# Altium project MODULIQ_Hub_ESP32-S3.PrjPcb
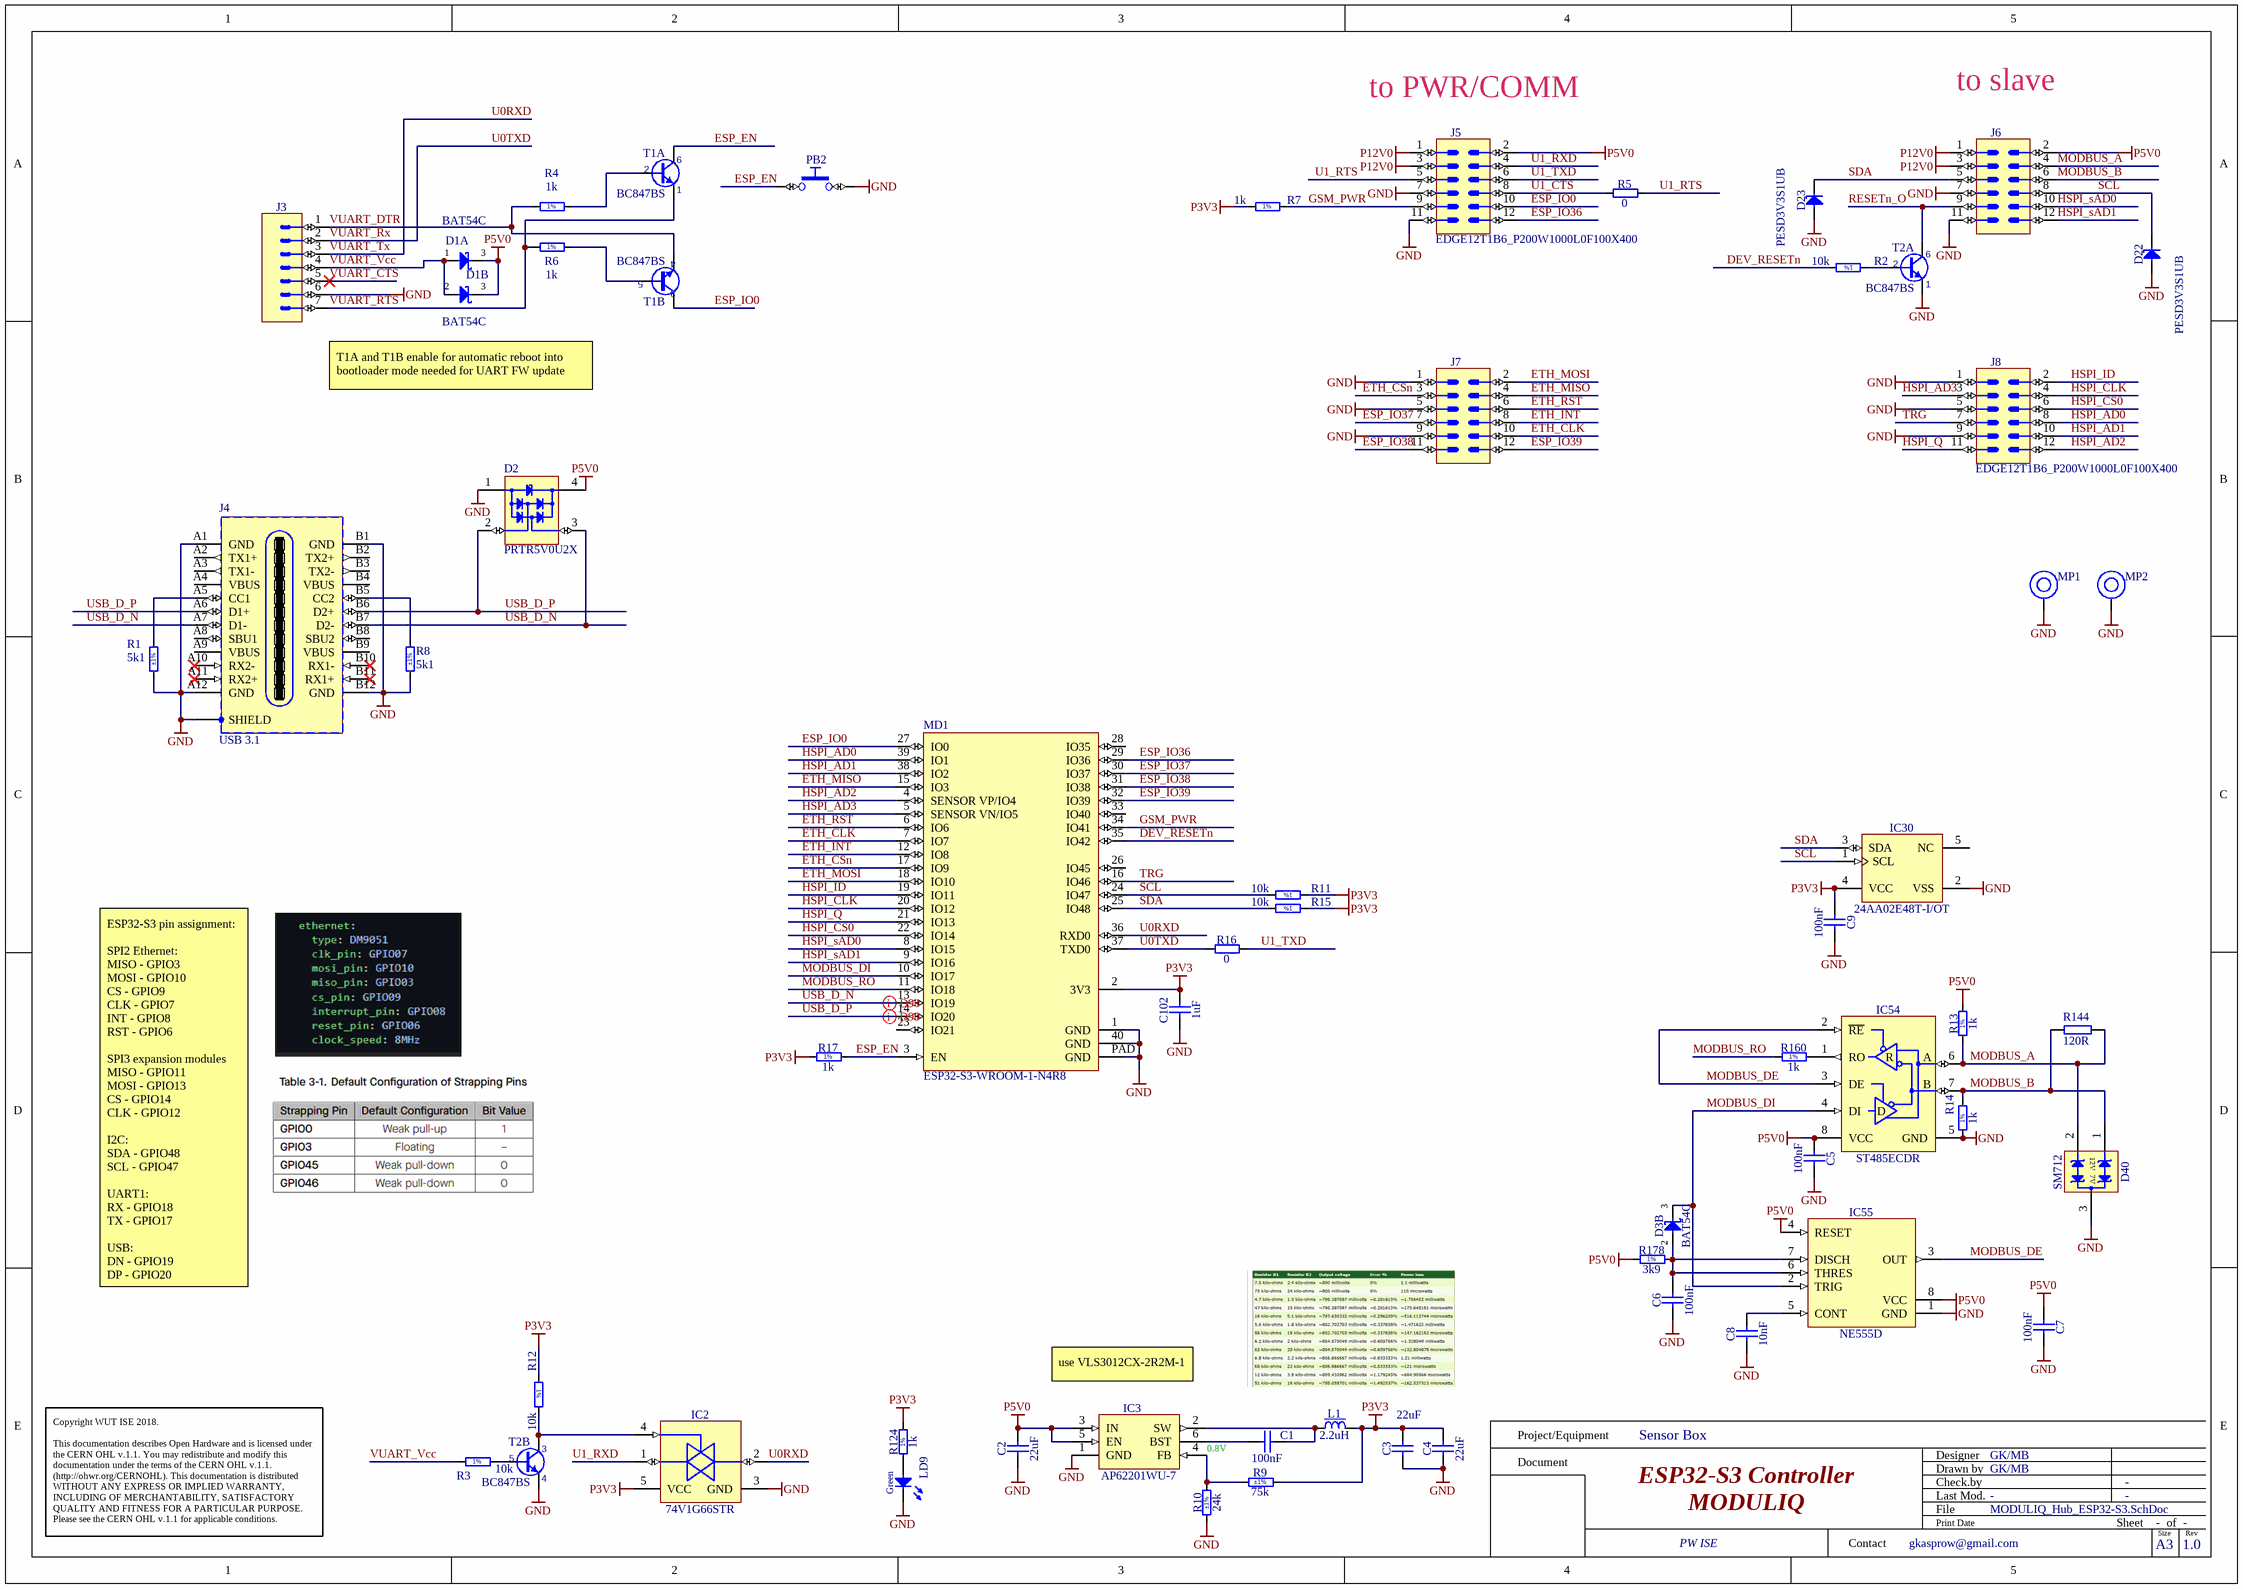
[diagram p0: MODULIQ_Hub_ESP32-S3.SchDoc]
1 sheet, 56 parts. Net scope: global (net labels, ports and power ports of the same name join across sheets).
Board file: MODULIQ_Hub_ESP32-S3.PcbDoc

## Sheet MODULIQ_Hub_ESP32-S3.SchDoc: ESP32-S3 Controller
size 420 x 297 mm; Author: GK/MB; CompanyName: WUT ISE; DrawnBy: GK/MB; Organization: WUT ISE; Address1: PW ISE; Address2: Nowowiejska 15/19 00-665 Warsaw; Address3: gkasprow@gmail.com; Revision: 1.0; SheetNumber: -; SheetTotal: -; ModifiedBy: -; CheckedDate: -; Title2: MODULIQ; DivGrp: WUT ISE; Designer: GK/MB; ModifiedDate: -; ProjectName: Sensor Box

### Parts
C1  100nF  [CAPC1005X55N]
C2  22uF  [CAPC2012X145N]
C3  22uF  [CAPC2012X145N]
C4  22uF  [CAPC2012X145N]
C5  100nF  [CAPC1005X55N]
C6  100nF  [CAPC1005X55N]
C7  100nF  [CAPC1005X55N]
C8  10nF  [CAPC1608X87N]
C9  100nF  [CAPC1005X55N]
C102  1uF  [CAPC1005X55N]
D1  BAT54C  [SOT95P240X130-3N]  (parts A,B of 2)
D2  PRTR5V0U2X  [SOT190P230X110-4N]
D3  BAT54C  [SOT95P240X130-3N]  (part B of 2)
D22  PESD3V3S1UB  [SODFL1608X65N]
D23  PESD3V3S1UB  [SODFL1608X65N]
D40  SM712  [SOT95P237X112-3N]
IC2  74V1G66STR  [SOT95P280X145-5N]
IC3  AP62201WU-7  [SOT95P285X110-6N]
IC30  24AA02E48T-I/OT  [SOT95P280X145-5N]
IC54  ST485ECDR  [SOIC127P600X175-8N]
IC55  NE555D  [SOIC127P600X175-8N]
J3  Header 7  [SAMTEC_TSW-107-07-L-S-LL]  (value not drawn)
J4  USB 3.1  [MOLEX_2047110001]
J5  (no value)  [EDGE12T1B6_P200W1000L0F100X400]
J6  (no value)  [EDGE12T5B10_P200W1000L0F100X400]
J7  (no value)  [EDGE12T5B10_P200W1000L0F100X400]
J8  (no value)  [EDGE12T1B6_P200W1000L0F100X400]
L1  2.2uH  [IND_MURATA_LQH44PN_P0]
LD9  Green  [LED_KINGBRIGHT_KPH-1608CGCK]
MD1  ESP32-S3-WROOM-1-N4R8  [ESP32-S3-WROOM-1]
MP1  M1.6 x 3mm  [97730306330]  (value not drawn)
MP2  M1.6 x 3mm  [97730306330]  (value not drawn)
PB2  Push Button  [PB_TYCO_FSMSM]  (value not drawn)
R1  5k1  Tolerance: ±1%  [RESC1005X40N]
R2  10k  [RESC1005X40N]
R3  10k  [RESC1005X40N]
R4  1k  [RESC1005X40N]
R5  0  [RESC1608X55N]
R6  1k  [RESC1005X40N]
R7  1k  [RESC1005X40N]
R8  5k1  Tolerance: ±1%  [RESC1005X40N]
R9  75k  Tolerance: ±1%  [RESC1005X40N]
R10  24k  Tolerance: ±1%  [RESC1005X40N]
R11  10k  [RESC1005X40N]
R12  10k  [RESC1005X40N]
R13  1k  [RESC1005X40N]
R14  1k  [RESC1005X40N]
R15  10k  [RESC1005X40N]
R16  0  [RESC1608X55N]
R17  1k  [RESC1005X40N]
R124  1k  [RESC1005X40N]
R144  120R  [1206R]
R160  1k  [RESC1005X40N]
R178  3k9  [RESC1005X40N]
T1  BC847BS  [SOT65P210X110-6N]  (parts A,B of 2)
T2  BC847BS  [SOT65P210X110-6N]  (parts A,B of 2)

### Nets
GND: C2.1 C3.1 C4.1 C5.2 C6.1 C7.2 C8.1 C9.2 C102.1 D2.1(GND) D22.2(A) D23.2(A) D40.3(GND) IC2.3(GND) IC3.1(GND) IC30.2(VSS) IC54.5(GND) IC55.1(GND) J3.6 J4.A1(GND) J4.A12(GND) J4.B1(GND) J4.B12(GND) J4.SHIELD J5.7 J5.11 J6.7 J6.11 J7.1 J7.5 J7.9 J8.1 J8.5 J8.9 LD9.1(C) MD1.1(GND) MD1.40(GND) MD1.PAD(GND) MP1.1 MP2.1 PB2.2 R1.1 R8.1 R10.1 R14.2 T2.1(E) T2.4(E)
P3V3: C3.2 C4.2 C9.1 C102.2 IC2.5(VCC) IC30.4(VCC) L1.2 MD1.2(3V3) R7.1 R9.2 R11.2 R12.2 R15.2 R17.1 R124.2
P5V0: C2.2 C5.1 C7.1 D1.3(COMC) D2.4(VCC) IC3.3(IN) IC3.5(EN) IC54.8(VCC) IC55.4(RESET) IC55.8(VCC) J5.2 J6.2 R13.1 R178.1
P12V0: J5.1 J5.3 J6.1 J6.3
DEV_RESETn: MD1.35(IO42) R2.1
ESP_EN: MD1.3(EN) PB2.1 R17.2 T1.6(C)
ESP_IO0: J5.10 MD1.27(IO0) T1.3(C)
ESP_IO36: J5.12 MD1.29(IO36)
ESP_IO37: J7.7 MD1.30(IO37)
ESP_IO38: J7.11 MD1.31(IO38)
ESP_IO39: J7.12 MD1.32(IO39)
ETH_CLK: J7.10 MD1.7(IO7)
ETH_CSn: J7.3 MD1.17(IO9)
ETH_INT: J7.8 MD1.12(IO8)
ETH_MISO: J7.4 MD1.15(IO3)
ETH_MOSI: J7.2 MD1.18(IO10)
ETH_RST: J7.6 MD1.6(IO6)
GSM_PWR: J5.9 MD1.34(IO41) R7.2
HSPI_AD0: J8.8 MD1.39(IO1)
HSPI_AD1: J8.10 MD1.38(IO2)
HSPI_AD2: J8.12 MD1.4(SENSOR_VP/IO4)
HSPI_AD3: J8.3 MD1.5(SENSOR_VN/IO5)
HSPI_CLK: J8.4 MD1.20(IO12)
HSPI_CS0: J8.6 MD1.22(IO14)
HSPI_ID: J8.2 MD1.19(IO11)
HSPI_Q: J8.11 MD1.21(IO13)
HSPI_sAD0: J6.10 MD1.8(IO15)
HSPI_sAD1: J6.12 MD1.9(IO16)
MODBUS_A: D40.2(I/O2) IC54.6(A) J6.4 R13.2 R144.2
MODBUS_B: D40.1(I/O1) IC54.7(B) J6.6 R14.1 R144.1
MODBUS_DE: IC54.2(~{RE}) IC54.3(DE) IC55.3(OUT)
MODBUS_DI: D3.3(COMC) IC54.4(DI) IC55.2(TRIG) MD1.10(IO17)
MODBUS_RO: MD1.11(IO18) R160.1
RESETn_O: J6.9 T2.6(C)
SCL: D22.1(C) IC30.1(SCL) J6.8 MD1.24(IO47) R11.1
SDA: D23.1(C) IC30.3(SDA) J6.5 MD1.25(IO48) R15.1
TRG: J8.7 MD1.16(IO46)
U0RXD: IC2.2(~{D0}) J3.3 MD1.36(RXD0)  [also labelled VUART_Tx]
U0TXD: J3.2 MD1.37(TXD0) R16.2  [also labelled VUART_Rx]
U1_CTS: J5.8 R5.1
U1_RTS: J5.5 R5.2
U1_RXD: IC2.1(D0) J5.4
U1_TXD: J5.6 R16.1
USB_D_N: D2.3(I/O2) J4.A7(D1-) J4.B7(D2-) MD1.13(IO19)
USB_D_P: D2.2(I/O1) J4.A6(D1+) J4.B6(D2+) MD1.14(IO20)
VUART_CTS: J3.5
VUART_DTR: J3.1 R4.1 T1.4(E)
VUART_RTS: J3.7 R6.1 T1.1(E)
VUART_Vcc: D1.1(A) D1.2(A) J3.4 R3.2
NetC1_1: C1.1 IC3.6(BST)
NetC1_2: C1.2 IC3.2(SW) L1.1
NetC6_2: C6.2 D3.2(A) IC55.6(THRES) IC55.7(DISCH) R178.2
NetC8_2: C8.2 IC55.5(CONT)
NetIC2_4: IC2.4(~{D1}) R12.1 T2.3(C)
NetIC3_4: IC3.4(FB) R9.1 R10.2
NetIC54_1: IC54.1(RO) R160.2
NetJ4_A5: J4.A5(CC1) R1.2
NetJ4_B5: J4.B5(CC2) R8.2
NetLD9_2: LD9.2(A) R124.1
NetR2_2: R2.2 T2.2(B)
NetR3_1: R3.1 T2.5(B)
NetR4_2: R4.2 T1.2(B)
NetR6_2: R6.2 T1.5(B)

Not connected (* = marked no-connect by the designer): IC30 5(NC); J4 A2(TX1+) A3(TX1-) A4(VBUS) A8(SBU1) A9(VBUS) A10(RX2-)* A11(RX2+)* B2(TX2+) B3(TX2-) B4(VBUS) B8(SBU2) B9(VBUS) B10(RX1-)* B11(RX1+)*; MD1 23(IO21) 26(IO45) 28(IO35) 33(IO40)

### Layout directives
differential pair; net class D90: USB_D_N, USB_D_P

### Notes on the sheet
- (near J5) to PWR/COMM
- to slave
- T1A and T1B enable for automatic reboot into bootloader mode needed for UART FW update
- ESP32-S3 pin assignment:
  SPI2 Ethernet:
  MISO - GPIO3
  MOSI - GPIO10
  CS - GPIO9
  CLK - GPIO7
  INT - GPIO8
  RST - GPIO6
  SPI3 expansion modules
  MISO - GPIO11
  MOSI - GPIO13
  CS - GPIO14
  CLK - GPIO12
  I2C:
  SDA - GPIO48
  SCL - GPIO47
  UART1:
  RX - GPIO18
  TX - GPIO17
  USB:
  DN - GPIO19
  DP - GPIO20
- use VLS3012CX-2R2M-1
- 0.8V
- Project/Equipment
- Document
- Designer
- Drawn by
- Check.by
- Copyright WUT ISE 2018.
  This documentation describes Open Hardware and is licensed under the CERN OHL v.1.1. You may redistribute and modify this documentation under the terms of the CERN OHL v.1.1. (http://ohwr.org/CERNOHL). This documentation is distributed WITHOUT ANY EXPRESS OR IMPLIED WARRANTY, INCLUDING OF MERCHANTABILITY, SATISFACTORY QUALITY AND FITNESS FOR A PARTICULAR PURPOSE. Please see the CERN OHL v.1.1 for applicable conditions.
- Contact
- File
- Last Mod.
- Print Date
- Sheet
- Size
- A3
- of
- Rev
- (in symbol R0402_1K_1%_0.0625W_100PPM) 1%
- (in symbol R0402_3K9_1%_0.0625W_100PPM) 1%
- (in symbol R0402_10K_1%_0.0625W_100PPM) 1%
- (in symbol SM712) 12V; 7V
- (in symbol ST485ECDR) R; D

### Library data of the parts
C1 = CC0402_100NF_16V_10%_X5R: Non-polarised capacitor; Part Description: SMD Multilayer Chip Ceramic Capacitor; Manufacturer: GENERIC; Manufacturer1 Part Number: GRM155R61C104KA88D; Voltage: 16V; TC: X5R; Tolerance: ±10%; Table: Capacitors SMD; Part Number: CC0402_100NF_16V_10%_X5R; Component Kind: Standard; Component Type: Standard; Pin Count: 2; Value: 100nF; Status: None; Manufacturer Part Number: CC0402_100NF_16V_10%_X5R; Case: 0402; Mounted: Yes; Socket: No; SMD: Yes; Manufacturer1 Example: MURATA; Manufacturer1 ComponentHeight: 0.55mm; HelpURL: \\cern.ch\dfs\Applications\Altium\Datasheets\CC0402_X5R_MURATA_GRM.pdf; Author: CERN DEM JLC; CreateDate: 2013-12-10; LatestRevisionDate: 2013-12-10
C2-C4 = CC0805_22UF_25V_20%_X5R: Non-polarised capacitor; Part Description: Chip Multilayer Ceramic Capacitor for General Purpose; Manufacturer: GENERIC; Manufacturer1 Part Number: GRM21BR61E226ME44; Voltage: 25V; TC: X5R; Tolerance: ±20%; Part Number: CC0805_22UF_25V_20%_X5R; Component Kind: Standard; Component Type: Standard; Pin Count: 2; Value: 22uF; Status: Preferred; Manufacturer Part Number: CC0805_22UF_25V_20%_X5R; Case: 0805; Mounted: Yes; Socket: No; SMD: Yes; Manufacturer1 Example: MURATA; Manufacturer1 ComponentHeight: 1.45mm; HelpURL: \\cern.ch\dfs\Applications\Altium\Datasheets\CC0805_MURATA_GRM21BR61E226ME44.pdf; Author: CERN DEM WB; CreateDate: 08.10.2021; LatestRevisionDate: 08.10.2021; Sense: No; ComponentHeight: 1.45mm
C5-C7 C9 = CC0402_100NF_16V_10%_X7R: Non-polarised capacitor; Part Description: SMD Multilayer Chip Ceramic Capacitor; Manufacturer: GENERIC; Manufacturer1 Part Number: GRM155R71C104KA88D; Voltage: 16V; TC: X7R; Tolerance: ±10%; Part Number: CC0402_100NF_16V_10%_X7R; Component Kind: Standard; Component Type: Standard; Pin Count: 2; Value: 100nF; Status: Not Recommended; Manufacturer Part Number: CC0402_100NF_16V_10%_X7R; Case: 0402; Mounted: Yes; Socket: No; SMD: Yes; Manufacturer1 Example: MURATA; Manufacturer1 ComponentHeight: 0.55mm; HelpURL: \\cern.ch\dfs\Applications\Altium\Datasheets\CC0402_X7R_MURATA_GRM.pdf; Author: CERN DEM JLC; CreateDate: 05.12.2013; LatestRevisionDate: 03.12.2007; Sense: No
C8 = CC0603_10NF_50V_5%_C0G: Non-polarised capacitor; Part Description: SMD Multilayer Chip Ceramic Capacitor; Manufacturer: GENERIC; Manufacturer1 Part Number: C1608C0G1H103J080AA; Voltage: 50V; TC: C0G/NP0; Tolerance: ±5%; Part Number: CC0603_10NF_50V_5%_C0G; Component Kind: Standard; Component Type: Standard; Pin Count: 2; Value: 10nF; Status: Preferred; Manufacturer Part Number: CC0603_10NF_50V_5%_C0G; Case: 0603; Mounted: Yes; Socket: No; SMD: Yes; Sense: No; Manufacturer1 Example: TDK; Manufacturer1 ComponentHeight: 0.9mm; HelpURL: \\cern.ch\dfs\Applications\Altium\Datasheets\CC0603_C0G_TDK_C.pdf; Author: CERN DEM JLC; CreateDate: 10.12.2014; LatestRevisionDate: 10.12.2014
C102 = CC0402_1UF_16V_10%_X5R: Non-polarised capacitor; Part Description: SMD Multilayer Chip Ceramic Capacitor; Manufacturer: GENERIC; Manufacturer1 Part Number: C1005X5R1C105KT; Voltage: 16V; TC: X5R; Tolerance: ±10%; Part Number: CC0402_1UF_16V_10%_X5R; Component Kind: Standard; Component Type: Standard; Pin Count: 2; Value: 1uF; Status: Preferred; Manufacturer Part Number: CC0402_1UF_16V_10%_X5R; Case: 0402; Mounted: Yes; Socket: No; SMD: Yes; Sense: No; Manufacturer1 Example: TDK; Manufacturer1 ComponentHeight: 0.55mm; HelpURL: \\cern.ch\dfs\Applications\Altium\Datasheets\CC0402_X5R_TDK_C.pdf; Author: CERN DEM JLC; CreateDate: 25.10.2012; LatestRevisionDate: 25.10.2012
D1 D3 = BAT54C: Dual Common Cathode Schottky Diodes; Part Description: Dual Common Cathode Small Signal Schottky Diode; Manufacturer: FAIRCHILD SEMICONDUCTOR; Voltage: 30V; Power: 200mA; PressFit: No; Bonding: No; Part Number: BAT54C; Component Kind: Standard; Component Type: Standard; Device: BAT54C; PackageDescription: SOT23 3-Leads, Pitch 0.95mm - Body 1.3x2.9mm, IPC Medium Density; Manufacturer Part Number: BAT54C; Pin Count: 3; Case: SOT23-3; Mounted: Yes; Socket: No; SMD: Yes; Sense: No; ComponentHeight: 1.30mm; HelpURL: \\cern.ch\dfs\Applications\Altium\Datasheets\BAT54C.pdf; Author: CERN DEM JLC; CreateDate: 17.09.2009; LatestRevisionDate: 27.05.2010
D2 = PRTR5V0U2X: Ultra Low Capacitance Double Rail-to-Rail ESD Protection Diode; Part Description: Ultra Low Capacitance (1pF) Double Rail-to-Rail ESD Protection Diode (8kV); Manufacturer: NXP SEMICONDUCTORS; Voltage: 5.5V; PressFit: No; Bonding: No; Part Number: PRTR5V0U2X; Component Kind: Standard; Component Type: Standard; Device: PRTR5V0U2X; PackageDescription: SOT143B, SOT, 1.90mm Pitch; 4 Pin, 1.30mm W X 2.90mm L X 1.10mm H body, IPC Medium Density; Manufacturer Part Number: PRTR5V0U2X; Pin Count: 4; Case: SOT143B; Mounted: Yes; Socket: No; SMD: Yes; Sense: No; ComponentHeight: 1.1mm; HelpURL: \\cern.ch\dfs\Applications\Altium\Datasheets\PRTR5V0U2X.pdf; Author: CERN DEM JLC; CreateDate: 3/22/2011; LatestRevisionDate: 3/22/2011
D22 D23 = PESD3V3S1UB: ESD protection diode; Part Description: ESD protection diode (23kV); Manufacturer: NXP SEMICONDUCTORS; Voltage: 3V3; Power: 330W; PressFit: No; Bonding: No; Part Number: PESD3V3S1UB; Component Kind: Standard; Component Type: Standard; Device: PESD3V3S1UB; PackageDescription: Ultra Small Outline Diode Flat Lead (SOD-523), Body; 1.2mm L X 0.8mm W X 0.65mm H, IPC Medium Density; Manufacturer Part Number: PESD3V3S1UB; Pin Count: 2; Case: SOD523; Mounted: Yes; Socket: No; SMD: Yes; Sense: No; ComponentHeight: 0.65mm; HelpURL: \\cern.ch\dfs\Applications\Altium\Datasheets\PESD3V3S1UB.pdf; Author: CERN DEM JLC; CreateDate: 29.11.2012; LatestRevisionDate: 29.11.2012
D40 = SM712: Asymmetrical TVS Diode for Extended Common-Mode RS-485; Manufacturer: SEMTECH; Voltage: 12V/-7V; Power: 400W; PressFit: No; Bonding: No; Part Number: SM712; Component Kind: Standard; Component Type: Standard; Device: SM712; PackageDescription: SOT, 0.95mm, pitch; 3 pin,1.30mm W X 2.92mm L X 1.12mm H body, IPC Medium Density; Status: Obsolete; Part Description: Asymmetrical TVS Diode for Extended Common-Mode RS-485; Manufacturer Part Number: SM712; Pin Count: 3; Case: SOT-23; Mounted: Yes; Socket: No; SMD: Yes; Sense: No; ComponentHeight: 1.12mm; HelpURL: \\cern.ch\dfs\Applications\Altium\Datasheets\SM712.pdf; Author: CERN DEM JLC; CreateDate: 23.04.2012; LatestRevisionDate: 23.04.2012
IC2 = 74V1G66STR: Single Bilateral Switch; Manufacturer: ST MICROELECTRONICS; PressFit: No; Bonding: No; Part Number: 74V1G66STR; Component Kind: Standard; Component Type: Standard; Device: 74V1G66STR; PackageDescription: SOT, 0.95mm pitch; 5 pin, 1.60mm W X 2.90mm L X 1.45mm H body, IPC Medium Density; Part Description: Single Bilateral Switch; Manufacturer Part Number: 74V1G66STR; Pin Count: 5; Case: SOT23-5; Mounted: Yes; Socket: No; SMD: Yes; Sense: No; ComponentHeight: 1.45mm; Author: CERN DEM JLC; HelpURL: \\cern.ch\dfs\Applications\Altium\Datasheets\74V1G66STR.pdf; CreateDate: 20.01.2014; LatestRevisionDate: 20.01.2014
IC3 = PM_AP62201WU-7: LIGHT LOAD IMPROVED 1.5A SYNCH DC/DC BUCK CONVERTER; Manufacturer: DIODES INCORPORATED; PressFit: No; Bonding: No; Part Number: AP62201WU-7; Component Kind: Standard; Component Type: Standard; Device: AP62201WU-7; PackageDescription: SOT23, 0.95mm pitch; 6 pin, 1.6mm W X 3.0mm L X 1.45mm H body, IPC Medium Density; Part Description: LIGHT LOAD IMPROVED 1.5A SYNCH DC/DC BUCK CONVERTER; Manufacturer Part Number: AP62201WU-7; Pin Count: 5; Case: SOT26; Mounted: Yes; Socket: No; SMD: Yes; Sense: No; ComponentHeight: 1.45mm; HelpURL: \\cern.ch\dfs\Applications\Altium\Datasheets\AP133-WG-7.pdf; Author: GK; CreateDate: 10.07.2015; LatestRevisionDate: 10.07.2015
IC30 = 24AA02E48T-I/OT: 1.7V-5.5V, 2K I2C Serial EEPROM With EUI-48 Node Identity; Manufacturer: MICROCHIP TECHNOLOGY; PressFit: No; Bonding: No; Part Number: 24AA02E48T-I/OT; Component Kind: Standard; Component Type: Standard; Device: 24AA02E48T-I/OT; PackageDescription: SOT, 0.95mm pitch; 5 pin, 1.60mm W X 2.90mm L X 1.45mm H body, IPC Medium Density; Part Description: 1.7V-5.5V, 2K I2C Serial EEPROM With EUI-48 Node Identity; Manufacturer Part Number: 24AA02E48T-I/OT; Pin Count: 5; Case: SOT23-5; Mounted: Yes; Socket: No; SMD: Yes; Sense: No; ComponentHeight: 1.45mm; HelpURL: \\cern.ch\dfs\Applications\Altium\Datasheets\24AA02E48T-I-OT.pdf; Author: CERN DEM MR; CreateDate: 31.03.2016; LatestRevisionDate: 31.03.2016
IC54 = ST485ECDR: ±15kV ESD-Protected, Low Power  RS-485/RS-422 Transceiver; Manufacturer: ST MICROELECTRONICS; PressFit: No; Bonding: No; Part Number: ST485ECDR; Component Kind: Standard; Component Type: Standard; Device: ST485ECDR; PackageDescription: SOIC 8, Pitch 1.27mm - Body 4x5mm, IPC Medium Density; Part Description: ±15kV ESD-Protected, Low Power  RS-485/RS-422 Transceiver; Manufacturer Part Number: ST485ECDR; Pin Count: 8; Case: SOIC8; Mounted: Yes; Socket: No; SMD: Yes; Sense: No; ComponentHeight: 1.75mm; Author: CERN DEM MR; HelpURL: \\cern.ch\dfs\Applications\Altium\Datasheets\ST485ECDR.pdf; CreateDate: 15.02.2018; LatestRevisionDate: 15.02.2018
IC55 = NE555D: Precision Timer; Manufacturer: TEXAS INSTRUMENTS; PressFit: No; Bonding: No; Part Number: NE555D; Component Kind: Standard; Component Type: Standard; Device: NE555D; PackageDescription: SOIC 8, Pitch 1.27mm, Body 4x5mm, IPC Medium Density; Part Description: Precision Timer; Manufacturer Part Number: NE555D; Pin Count: 8; Case: SOIC8; Mounted: Yes; Socket: No; SMD: Yes; Sense: No; ComponentHeight: 1.75mm; Author: CERN DEM JMW; HelpURL: \\cern.ch\dfs\Applications\Altium\Datasheets\NE555D.pdf; CreateDate: 16.04.2009; LatestRevisionDate: 16.04.2009
J3 = SAMTEC_TSW-107-07-L-S-LL: Connector 7 Male; Part Description: 7 Contacts, Pitch 2.54mm, Single Row  Through Mount Straigh Header (Post Lead 5.84mm, Tail Lead 2.54mm, Insulator 2.54mm); Manufacturer: SAMTEC; PressFit: No; Part Number: SAMTEC_TSW-107-07-L-S-LL; Component Kind: Standard; Component Type: Standard; Pin Count: 7; Family: Header 7; Mounted: Yes; Socket: No; SMD: No; Sense: No; Status: None; Manufacturer Part Number: TSW-107-07-L-S-LL; ComponentHeight: 8.38mm; HelpURL: \\cern.ch\dfs\Applications\Altium\Datasheets\SAMTEC_TSW-107-07-L-S-LL.pdf; Author: CERN DEM MR; CreateDate: 07.12.2016; LatestRevisionDate: 07.12.2016
J4 = 2047110001: 2x12 Pin + 1 Shield  USB Type C Receptacle; Part Description: Universal Serial Bus (USB) Shielded I/O Receptacle, Type C, Vertical, Surface Mount, 0.76µm Gold (Au) Plating, 1.40mm Solder Tab; Manufacturer: MOLEX; Arena Part Number: 125-000079; PressFit: No; Part Number: 2047110001; Component Kind: Standard; Component Type: Standard; Pin Count: 30; Family: USB 3.1; SMD: Yes; Status: Active; Manufacturer Part Number: 2047110001; ComponentHeight: 9.8mm; Author: Michal Beldyga; CreateDate: 4/29/2025; LatestRevisionDate: 4/29/2025
J5 J8 = PCB Edge Connector 12 (2x6): Part Number: EDGE10T1B6_P200W1000L0F100X400; Part Description: 10 Contacts Board Edge Connector, Pitch 2mm, Length 0mm, Width 10mm, Finger Lenght 4mm, Finger Width 1mm; Mounted: No; PressFit: No; Component Kind: Standard (No BOM); Component Type: Standard (No BOM); Pin Count: 12; Socket: No; SMD: No; Sense: No; Status: None; ComponentHeight: 0mm; HelpURL: \\cern.ch\dfs\Applications\Altium\Datasheets\EDGE10T1B6_P200W1000L0F100X400.pdf; Author: CERN DEM MR; CreateDate: 14.02.2018; LatestRevisionDate: 14.02.2018
J6 J7 = PCB Edge Connector 12 (2x6) R: PCB Edge Connector 12 (2x6); Part Description: 12 Contacts Board Edge Connector, Pitch 2mm, Length 0mm, Width 10mm, Finger Lenght 4mm, Finger Width 1mm; Mounted: No; PressFit: No; Part Number: EDGE12T5B10_P200W1000L0F100X400; Component Kind: Standard (No BOM); Component Type: Standard (No BOM); Pin Count: 12; Socket: No; SMD: No; Sense: No; Status: None; ComponentHeight: 0mm; HelpURL: \\cern.ch\dfs\Applications\Altium\Datasheets\EDGE10T5B10_P200W1000L0F100X400.pdf; Author: GK; CreateDate: 14.02.2018; LatestRevisionDate: 14.02.2018
L1 = IND_2.2UH_20%_MURATA_LQH44PN2R2MP0L: Inductor With Core; Part Description: Wire Wound Ferrite Inductor for Power Lines; Manufacturer: MURATA; Power: 1.8A; Resistance: 0R049; Tolerance: ±20%; Part Number: IND_2.2UH_20%_MURATA_LQH44PN2R2MP0L; Component Kind: Standard; Component Type: Standard; Pin Count: 2; Value: 2.2uH; Status: None; Manufacturer Part Number: LQH44PN2R2MP0L; Case: 4040; Mounted: Yes; Socket: No; SMD: Yes; Sense: No; ComponentHeight: 1.8mm; HelpURL: \\cern.ch\dfs\Applications\Altium\Datasheets\IND_MURATA_LQH44PN_P0.pdf; Author: CERN DEM JLC; CreateDate: 14.02.2018; LatestRevisionDate: 14.02.2018
LD9 = LED_KINGBRIGHT_KPH-1608CGCK: LED Green 1C 2A; Part Description: SMD Green LED, Case 1.6mmX0.8mm(0603), 0.65mm Thickness; PressFit: No; Bonding: No; Part Number: LED_KINGBRIGHT_KPH-1608CGCK; Component Kind: Standard; Component Type: Standard; Color: Green; PackageDescription: SMT Green LED, Case 0603, Body L 1.6 x W 0.8mm H 0.65mm; Manufacturer: KINGBRIGHT; Manufacturer Part Number: KPH-1608CGCK; Pin Count: 2; Mounted: Yes; Socket: No; SMD: Yes; Sense: No; ComponentHeight: 0.65mm; HelpURL: \\cern.ch\dfs\Applications\Altium\Datasheets\LED_KINGBRIGHT_KPH-1608CGCK.pdf; Author: CERN DEM JLC; CreateDate: 03/07/2017; LatestRevisionDate: 03/07/2017
MD1 = ESP32-S3-WROOM-1-N4R8: WiFi-Modul 802.11/BT 2, 4-2, 5GHz 150Mb/s; Manufacturer: Espressif Systems; Max Supply Voltage: 3.6V; Min Supply Voltage: 3V; Operating Supply Voltage: 3.3V; Supplier: Digikey; Supplier Part Number: 5407-ESP32-S3-WROOM-1-N4R8CT-ND; Manufacturer Part Number: ESP32-S3-WROOM-1-N4R8; RoHS: No; Stock: 3923; Pricing: 1=5.71, 10=4.941, 25=4.6748, 100=4.3087, 250=4.0894, 650=3.87826, 1300=3.7356, 1950=3.65604 (USD); Pins: 41NUMBER; Min Operating Temperature: -40°C; Max Operating Temperature: 65°C; Length: 25.5mm; Width: 18mm; Height - Seated (Max): 3.25mm; Terminal Pitch: 1.27mm; ComponentLink1URL: https://datasheet.octopart.com/ESP32-S3-WROOM-1-N4R8-Espressif-Systems-datasheet-165560563.pdf?src-supplier=TME; ComponentLink1Description: https://datasheet.octopart.com/ESP32-S3-WROOM-1-N4R8-Espressif-Systems-datasheet-165560563.pdf?src-supplier=TME
MP1 MP2 = 97730306330R: WA-SMSI SMT Steel Spacer with internal Thread Bottom closed, OD 3.3mm, M1.6 x 3mm; Manufacturer: Wurth Elektronik; Inside Thread Length: 1.8mm; Surface: Tin; ComponentLink1Description: Website Link; ComponentLink1URL: https://www.we-online.com/redexpert/article/97730306330R?ad; ComponentLink2Description: Datasheet Link; ComponentLink2URL: https://www.we-online.com/redexpert/spec/97730306330R?ad; Manufacturer Part Number: 97730306330R; Category: SMT Spacers; Match Code: WA-SMSI; Mount: Surface Mount; Operating Temperature Max: 150°C; Operating Temperature Min: -55°C; Packaging: Tape and Reel; Height: 3mm; Material: Steel; Outside Diameter: 3.3mm; Thread Size: M1.6
PB2 = PB_TYCO_FSMSM: Push-Button Switch SPDT; Part Description: 12VDC 50mA SPST Tactile  Push-Button Switch; Manufacturer: TYCO ELECTRONICS; Manufacturer Part Number: FSMSM or 1437566-3; PressFit: No; Part Number: PB_TYCO_FSMSM; Component Kind: Standard; Component Type: Standard; Pin Count: 2; PackageDescription: Body 3.5x6.0mm, Pushbutton Switch,  TYCO ALCOSWITCH FSMSM Serie; Family: Push Button; Mounted: Yes; Socket: No; SMD: Yes; Sense: No; Status: None; ComponentHeight: 4.3mm; HelpURL: \\cern.ch\dfs\Applications\Altium\Datasheets\PB_TYCO_FSMSM.pdf; Author: CERN DEM JLC; CreateDate: 30.06.2008; LatestRevisionDate: 21.06.2012
R1 R8 = R0402_5K1_1%_0.0625W_100PPM: Resistor - 1%; Part Description: General Purpose Thick Film Chip Resistor; Manufacturer: GENERIC; Manufacturer1 Part Number: 232270675102L; TC: ±100ppm/°C; PressFit: No; Part Number: R0402_5K1_1%_0.0625W_100PPM; Component Kind: Standard; Component Type: Standard; Pin Count: 2; Value: 5k1; Status: Not Recommended; Power: 0.0625W; Manufacturer Part Number: R0402_5K1_1%_0.0625W_100PPM; Case: 0402; Mounted: Yes; Sense: No; Socket: No; SMD: Yes; Manufacturer1 Example: YAGEO PHYCOMP; Manufacturer1 ComponentHeight: 0.4mm; HelpURL: \\cern.ch\dfs\Applications\Altium\Datasheets\R0402_Phycomp_RC0402.pdf; Author: CERN DEM JLC; CreateDate: 12/3/2007; LatestRevisionDate: 10/17/2012
R2 R3 R11 R12 R15 = R0402_10K_1%_0.0625W_100PPM: Resistor - 1%; Part Description: General Purpose Thick Film Chip Resistor; Manufacturer: GENERIC; Manufacturer1 Part Number: 232270671003L; TC: ±100ppm/°C; Table: Resistors SMD; Part Number: R0402_10K_1%_0.0625W_100PPM; Component Kind: Standard; Component Type: Standard; Pin Count: 2; Value: 10k; Status: Not recommended; Power: 0.0625W; Tolerance: ±1%; Manufacturer Part Number: R0402_10K_1%_0.0625W_100PPM; Case: 0402; Mounted: Yes; Socket: No; SMD: Yes; Manufacturer1 Example: YAGEO PHYCOMP; Manufacturer1 ComponentHeight: 0.4mm; HelpURL: \\cern.ch\dfs\Applications\Altium\Datasheets\R0402_Phycomp_RC0402.pdf; Author: CERN DEM JLC; CreateDate: 2007-12-03; LatestRevisionDate: 2012-10-17
R4 R6 R7 R13 R14 R17 R124 R160 = R0402_1K_1%_0.0625W_100PPM: Resistor - 1%; Part Description: General Purpose Thick Film Chip Resistor; Manufacturer: GENERIC; Manufacturer1 Part Number: 232270671002L; TC: ±100ppm/°C; PressFit: No; Part Number: R0402_1K_1%_0.0625W_100PPM; Component Kind: Standard; Component Type: Standard; Pin Count: 2; Value: 1k; Status: Not Recommended; Power: 0.0625W; Tolerance: ±1%; Manufacturer Part Number: R0402_1K_1%_0.0625W_100PPM; Case: 0402; Mounted: Yes; Sense: No; Socket: No; SMD: Yes; Manufacturer1 Example: YAGEO PHYCOMP; Manufacturer1 ComponentHeight: 0.4mm; HelpURL: \\cern.ch\dfs\Applications\Altium\Datasheets\R0402_Phycomp_RC0402.pdf; Author: CERN DEM JLC; CreateDate: 03.12.2007; LatestRevisionDate: 17.10.2012
R5 R16 = R0603_0R_JUMPER: Resistor; Part Description: 1A (0.05R Max DC Resistance) Zero Ohm Jumper; Manufacturer: GENERIC; Manufacturer1 Part Number: NRC06Z0; PressFit: No; Part Number: R0603_0R_JUMPER; Component Kind: Standard; Component Type: Standard; Pin Count: 2; Value: 0; Status: Preferred; Manufacturer Part Number: R0603_0R_JUMPER; Case: 0603; Mounted: Yes; Sense: No; Socket: No; SMD: Yes; Manufacturer1 Example: NIC COMPONENT; Manufacturer1 ComponentHeight: 0.55mm; HelpURL: \\cern.ch\dfs\Applications\Altium\Datasheets\R0603_NIC_NRC.pdf; Author: CERN DEM JLC; CreateDate: 03.12.2007; LatestRevisionDate: 13.03.2008
R9 = R0402_75K_1%_0.0625W_100PPM: Resistor - 1%; Part Description: General Purpose Thick Film Chip Resistor; Manufacturer: GENERIC; Manufacturer1 Part Number: 232270677503L; TC: ±100ppm/°C; PressFit: No; Part Number: R0402_75K_1%_0.0625W_100PPM; Component Kind: Standard; Component Type: Standard; Pin Count: 2; Value: 75k; Status: Not Recommended; Power: 0.0625W; Manufacturer Part Number: R0402_75K_1%_0.0625W_100PPM; Case: 0402; Mounted: Yes; Sense: No; Socket: No; SMD: Yes; Manufacturer1 Example: YAGEO PHYCOMP; Manufacturer1 ComponentHeight: 0.4mm; HelpURL: \\cern.ch\dfs\Applications\Altium\Datasheets\R0402_Phycomp_RC0402.pdf; Author: CERN DEM JLC; CreateDate: 03.12.2007; LatestRevisionDate: 17.10.2012
R10 = R0402_24K_1%_0.0625W_100PPM: Resistor - 1%; Part Description: General Purpose Thick Film Chip Resistor; Manufacturer: GENERIC; Manufacturer1 Part Number: 232270672403L; TC: ±100ppm/°C; PressFit: No; Part Number: R0402_24K_1%_0.0625W_100PPM; Component Kind: Standard; Component Type: Standard; Pin Count: 2; Value: 24k; Status: Not Recommended; Power: 0.0625W; Manufacturer Part Number: R0402_24K_1%_0.0625W_100PPM; Case: 0402; Mounted: Yes; Sense: No; Socket: No; SMD: Yes; Manufacturer1 Example: YAGEO PHYCOMP; Manufacturer1 ComponentHeight: 0.4mm; HelpURL: \\cern.ch\dfs\Applications\Altium\Datasheets\R0402_Phycomp_RC0402.pdf; Author: CERN DEM JLC; CreateDate: 03.12.2007; LatestRevisionDate: 17.10.2012
R144 = RES_1206: SMD Resistor; Supplier 1: Newark; Supplier Part Number 1: 39K0871
R178 = R0402_3K9_1%_0.0625W_100PPM: Resistor - 1%; Part Description: General Purpose Thick Film Chip Resistor; Manufacturer: GENERIC; Manufacturer1 Part Number: 232270673902L; TC: ±100ppm/°C; PressFit: No; Part Number: R0402_3K9_1%_0.0625W_100PPM; Component Kind: Standard; Component Type: Standard; Pin Count: 2; Value: 3k9; Status: Not Recommended; Power: 0.0625W; Tolerance: ±1%; Manufacturer Part Number: R0402_3K9_1%_0.0625W_100PPM; Case: 0402; Mounted: Yes; Sense: No; Socket: No; SMD: Yes; Manufacturer1 Example: YAGEO PHYCOMP; Manufacturer1 ComponentHeight: 0.4mm; HelpURL: \\cern.ch\dfs\Applications\Altium\Datasheets\R0402_Phycomp_RC0402.pdf; Author: CERN DEM JLC; CreateDate: 03.12.2007; LatestRevisionDate: 17.10.2012
T1 T2 = BC847BS: 45V 100mA Dual NPN General-Purpose Transistor; Manufacturer: NXP SEMICONDUCTORS; PressFit: No; Bonding: No; Part Number: BC847BS; Component Kind: Standard; Component Type: Standard; Device: BC847BS; PackageDescription: SOT363, SC-88, SOT, 0.65mm Pitch, 6 pin, 1.25mm W X 2.00mm L X 1.10mm H, IPC Medium Density; Part Description: 45V 100mA Dual NPN General-Purpose Transistor; Manufacturer Part Number: BC847BS; Pin Count: 6; Case: SOT363; Mounted: Yes; Socket: No; SMD: Yes; Sense: No; ComponentHeight: 1.1mm; HelpURL: \\cern.ch\dfs\Applications\Altium\Datasheets\BC847BS.pdf; Author: CERN DEM JMW; CreateDate: 10.07.2015; LatestRevisionDate: 10.07.2015